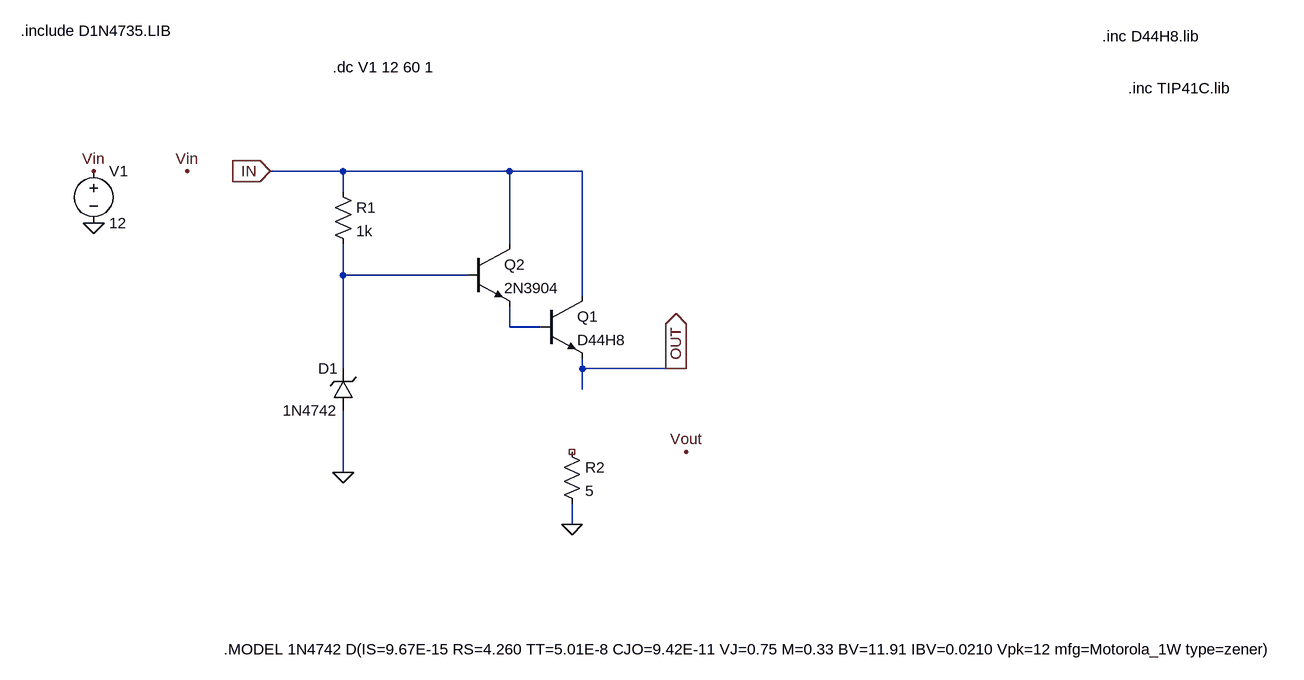
[diagram p0: schematic Regulador10_5.asc]
Regulador10_5.asc, the LTspice schematic file:
Version 4
SHEET 1 1396 960
WIRE -64 208 -176 208
WIRE 192 208 -64 208
WIRE 304 208 192 208
WIRE -64 240 -64 208
WIRE 192 320 192 208
WIRE -64 368 -64 320
WIRE 128 368 -64 368
WIRE 304 400 304 208
WIRE 192 448 192 416
WIRE 240 448 192 448
WIRE -64 512 -64 368
WIRE 304 512 304 496
WIRE 448 512 304 512
WIRE 464 512 448 512
WIRE 304 544 304 512
WIRE -64 672 -64 576
WIRE 288 752 288 720
FLAG -448 288 0
FLAG -304 208 Vin
FLAG -448 208 Vin
FLAG 288 752 0
FLAG -64 672 0
FLAG 464 640 Vout
FLAG -176 208 IN
IOPIN -176 208 In
FLAG 448 512 OUT
IOPIN 448 512 Out
SYMBOL voltage -448 192 R0
SYMATTR InstName V1
SYMATTR Value 12
SYMBOL zener -48 576 R180
WINDOW 0 24 64 Left 2
WINDOW 3 24 0 Left 2
SYMATTR InstName D1
SYMATTR Value 1N4742
SYMATTR Description Diode
SYMATTR Type diode
SYMBOL res -80 224 R0
SYMATTR InstName R1
SYMATTR Value 1k
SYMATTR SpiceLine tol=1 pwr=0.1
SYMBOL npn 240 400 R0
SYMATTR InstName Q1
SYMATTR Value D44H8
SYMBOL npn 128 320 R0
SYMATTR InstName Q2
SYMATTR Value 2N3904
SYMBOL res 272 624 R0
SYMATTR InstName R2
SYMATTR Value 5
SYMATTR SpiceLine tol=1 pwr=0.1
TEXT -560 -8 Left 2 !.include D1N4735.LIB
TEXT 1144 80 Left 2 !.inc TIP41C.lib
TEXT -248 944 Left 2 !.MODEL 1N4742 D(IS=9.67E-15 RS=4.260 TT=5.01E-8 CJO=9.42E-11 VJ=0.75 M=0.33 BV=11.91 IBV=0.0210 Vpk=12 mfg=Motorola_1W type=zener)
TEXT 1104 0 Left 2 !.inc D44H8.lib
TEXT -80 48 Left 2 !.dc V1 12 60 1

The netlist it stands for:
* Regulador10_5.asc
V1 Vin 0 12
D1 0 N001 1N4742
R1 IN N001 1k tol=1 pwr=0.1
Q1 IN N002 OUT 0 D44H8
Q2 IN N001 N002 0 2N3904
R2 NC_01 0 5 tol=1 pwr=0.1
.model D D
.lib standard.dio
.model NPN NPN
.model PNP PNP
.lib standard.bjt
.include D1N4735.LIB
.inc TIP41C.lib
.MODEL 1N4742 D(IS=9.67E-15 RS=4.260 TT=5.01E-8 CJO=9.42E-11 VJ=0.75 M=0.33 BV=11.91 IBV=0.0210 Vpk=12 mfg=Motorola_1W type=zener)
.inc D44H8.lib
.dc V1 12 60 1
.backanno
.end